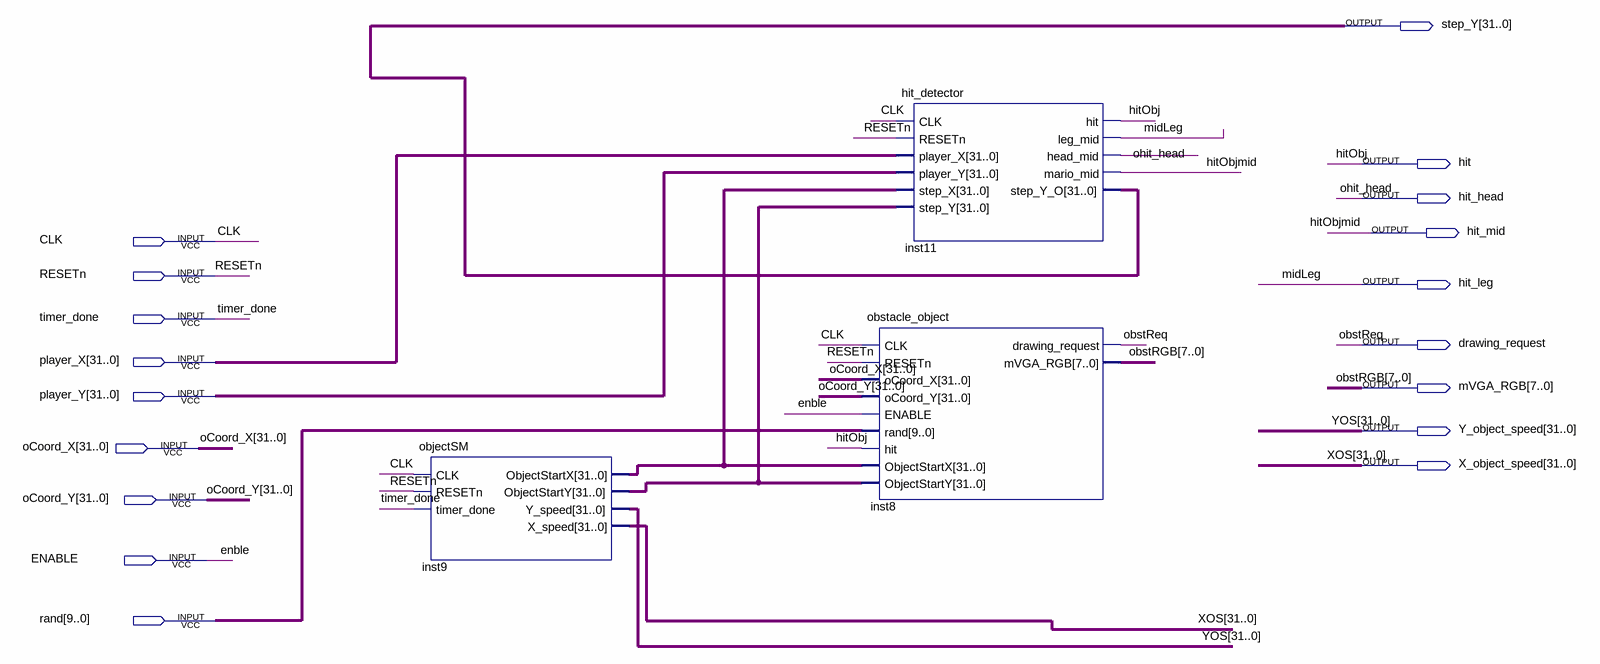
[diagram p0: schematic sheet]
// Quartus schematic ObstcleFull.bdf as structural Verilog: 3 symbols, 18 pins
module ObstcleFull (
  input  CLK,
  input  RESETn,
  input  timer_done,
  input  [31:0] player_X,
  input  [31:0] player_Y,
  input  [31:0] oCoord_X,
  input  [31:0] oCoord_Y,
  input  ENABLE,
  input  [9:0] \rand ,
  output [31:0] step_Y,
  output hit,
  output hit_head,
  output hit_mid,
  output hit_leg,
  output drawing_request,
  output [7:0] mVGA_RGB,
  output [31:0] Y_object_speed,
  output [31:0] X_object_speed
);

  wire [31:0] inst9_objectstartx, inst9_objectstarty;

  objectSM inst9 (
    .CLK(CLK), .RESETn(RESETn), .timer_done(timer_done), .ObjectStartX(inst9_objectstartx),
    .ObjectStartY(inst9_objectstarty), .Y_speed(Y_object_speed), .X_speed(X_object_speed));
  hit_detector inst11 (
    .CLK(CLK), .RESETn(RESETn), .player_X(player_X), .player_Y(player_Y), .step_X(inst9_objectstartx),
    .step_Y(inst9_objectstarty), .hit(hit), .leg_mid(hit_leg), .head_mid(hit_head), .mario_mid(hit_mid),
    .step_Y_O(step_Y));
  obstacle_object inst8 (
    .CLK(CLK), .RESETn(RESETn), .oCoord_X(oCoord_X), .oCoord_Y(oCoord_Y), .ENABLE(ENABLE), .\rand (\rand ),
    .hit(hit), .ObjectStartX(inst9_objectstartx), .ObjectStartY(inst9_objectstarty),
    .drawing_request(drawing_request), .mVGA_RGB(mVGA_RGB));

  // Other names for the same wires on the sheet: enble = ENABLE; hitObj = hit; hitObjmid = hit_mid; midLeg = hit_leg;
  //   obstReq = drawing_request; obstRGB[7:0] = mVGA_RGB; ohit_head = hit_head; XOS[31:0] = X_object_speed;
  //   YOS[31:0] = Y_object_speed
endmodule
